# Altium schematic sheet 原理图.SchDoc
size A4
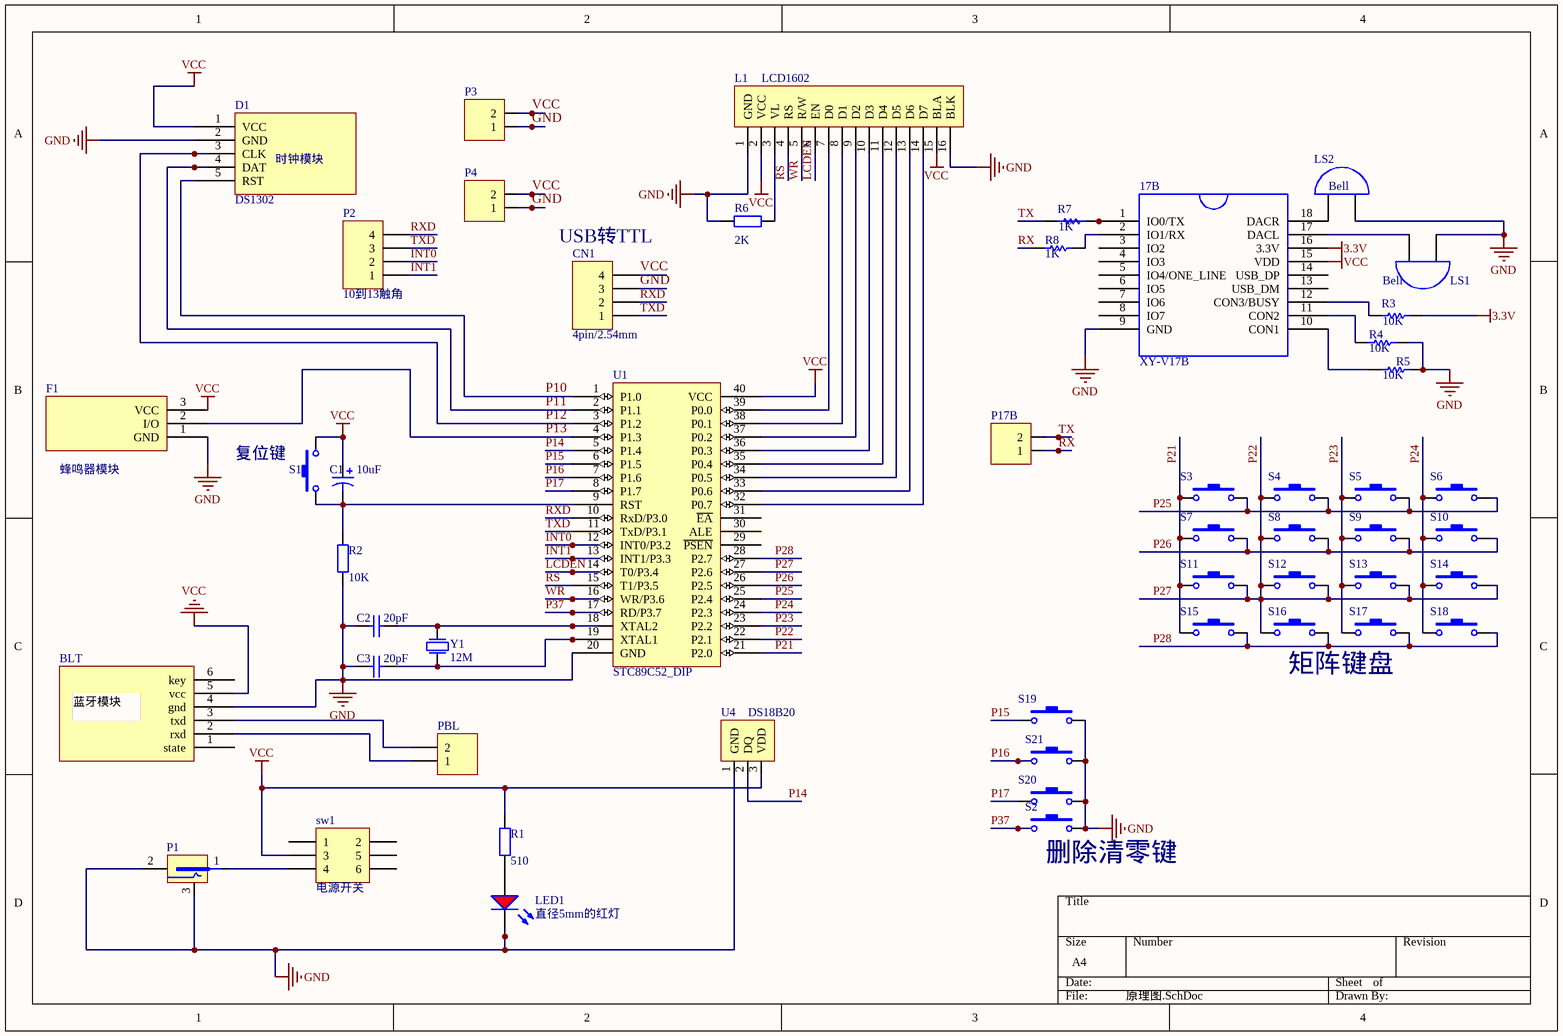
[diagram p0: 原理图.SchDoc]

## Parts
17B  XY-V17B  [17B]
BLT  (no value)  [BLE]
C1  10uF  [CAPPR3.5-8X12]
C2  20pF  [P4]
C3  20pF  [P4]
CN1  4pin/2.54mm  [CN1]
D1  DS1302  [DS1302]
F1  蜂鸣器模块  [BEEP]
L1  LCD1602  [LCD1602]
LED1  直径5mm的红灯  [LED_#5_Red]
LS1  Bell  [PIN2]
LS2  Bell  [PIN2]
P1  电源输入  [POWER111]  (value not drawn)
P2  10到13触角  [CN1]
P3  (no value)  [P4]
P4  (no value)  [P4]
P17B  (no value)  [P4]
PBL  (no value)  [P4]
R1  value 510  [AXIAL-0.4]
R2  value 10K  [AXIAL-0.4]
R3  value 10K  [AXIAL-0.3]
R4  value 10K  [AXIAL-0.3]
R5  value 10K  [AXIAL-0.3]
R6  value 2K  [AXIAL-0.4]
R7  value 1K  [AXIAL-0.3]
R8  value 1K  [AXIAL-0.3]
S1  SW-PB  [KEY2]  (value not drawn)
S2  SW-PB  [KEY2]  (value not drawn)
S3  SW-PB  [KEY2]  (value not drawn)
S4  SW-PB  [KEY2]  (value not drawn)
S5  SW-PB  [KEY2]  (value not drawn)
S6  SW-PB  [KEY2]  (value not drawn)
S7  SW-PB  [KEY2]  (value not drawn)
S8  SW-PB  [KEY2]  (value not drawn)
S9  SW-PB  [KEY2]  (value not drawn)
S10  SW-PB  [KEY2]  (value not drawn)
S11  SW-PB  [KEY2]  (value not drawn)
S12  SW-PB  [KEY2]  (value not drawn)
S13  SW-PB  [KEY2]  (value not drawn)
S14  SW-PB  [KEY2]  (value not drawn)
S15  SW-PB  [KEY2]  (value not drawn)
S16  SW-PB  [KEY2]  (value not drawn)
S17  SW-PB  [KEY2]  (value not drawn)
S18  SW-PB  [KEY2]  (value not drawn)
S19  SW-PB  [KEY2]  (value not drawn)
S20  SW-PB  [KEY2]  (value not drawn)
S21  SW-PB  [KEY2]  (value not drawn)
sw1  电源开关  [电源]
U1  STC89C52_DIP  [DIP-40]
U4  DS18B20  [DS18B20]
Y1  12M  [XTAL-49/U_N]

## Nets
3.3V: 17B.16(3.3V) R3.2
GND: 17B.9(GND) BLT.4(gnd) C2.1 C3.1 CN1.3 D1.2(GND) F1.1(GND) L1.1(GND) L1.16(BLK) LED1.2 LS1.1(A) LS2.2(B) P1.2 P1.3 P3.1 P4.1 R2.2 R4.2 R5.2 R6.1 S2.2 S19.2 S20.2 S21.2 U1.20(GND) U4.1(GND)
VCC: 17B.15(VDD) BLT.5(vcc) C1.1 CN1.4 D1.1(VCC) F1.3(VCC) L1.2(VCC) L1.15(BLA) P3.2 P4.2 R1.1 S1.2 sw1.3 U1.40(VCC) U4.3(VDD)
INT0: P2.2 U1.12(INT0/P3.2)
INT1: P2.1 U1.13(INT1/P3.3)
LCDEN: L1.6(EN) U1.14(T0/P3.4)
P10: D1.5(RST) U1.1(P1.0)
P11: D1.4(DAT) U1.2(P1.1)
P12: D1.3(CLK) U1.3(P1.2)
P13: F1.2(I/O) U1.4(P1.3)
P14: U1.5(P1.4) U4.2(DQ)
P15: S19.1 U1.6(P1.5)
P16: S21.1 U1.7(P1.6)
P17: S20.1 U1.8(P1.7)
P21: S3.1 S7.1 S11.1 S15.1 U1.21(P2.0)
P22: S4.1 S8.1 S11.2 S12.1 S12.2 S13.2 S14.2 S16.1 U1.22(P2.1) U1.27(P2.6)  [also labelled P27]
P23: S5.1 S9.1 S13.1 S17.1 U1.23(P2.2)
P24: S6.1 S10.1 S14.1 S18.1 U1.24(P2.3)
P25: S3.2 S4.2 S5.2 S6.2 U1.25(P2.4)
P26: S7.2 S8.2 S9.2 S10.2 U1.26(P2.5)
P28: S15.2 S16.2 S17.2 S18.2 U1.28(P2.7)
P37: S2.1 U1.17(RD/P3.7)
RS: L1.4(RS) U1.15(T1/P3.5)
RX: P17B.1 R8.1
RXD: CN1.2 P2.4 U1.10(RxD/P3.0)
TX: P17B.2 R7.1
TXD: CN1.1 P2.3 U1.11(TxD/P3.1)
WR: L1.5(R/W) U1.16(WR/P3.6)
Net17B_1: 17B.1(IO0/TX) R7.2
Net17B_2: 17B.2(IO1/RX) R8.2
Net17B_10: 17B.10(CON1) R5.1
Net17B_11: 17B.11(CON2) R4.1
Net17B_12: 17B.12(CON3/BUSY) R3.1
Net17B_17: 17B.17(DACL) LS1.2(B)
Net17B_18: 17B.18(DACR) LS2.1(A)
NetBLT_2: BLT.2(rxd) PBL.1
NetBLT_3: BLT.3(txd) PBL.2
NetC1_2: C1.2 R2.1 S1.1 U1.9(RST)
NetC2_2: C2.2 U1.18(XTAL2) Y1.1(P1)
NetC3_2: C3.2 U1.19(XTAL1) Y1.2(P2)
NetL1_3: L1.3(VL) R6.2
NetL1_7: L1.7(D0) U1.39(P0.0)
NetL1_8: L1.8(D1) U1.38(P0.1)
NetL1_9: L1.9(D2) U1.37(P0.2)
NetL1_10: L1.10(D3) U1.36(P0.3)
NetL1_11: L1.11(D4) U1.35(P0.4)
NetL1_12: L1.12(D5) U1.34(P0.5)
NetL1_13: L1.13(D6) U1.33(P0.6)
NetL1_14: L1.14(D7) U1.32(P0.7)
NetLED1_1: LED1.1 R1.2
NetP1_1: P1.1 sw1.4

Not connected (* = marked no-connect by the designer): 17B 3(IO2) 4(IO3) 5(IO4/ONE_LINE) 6(IO5) 7(IO6) 8(IO7) 13(USB_DM) 14(USB_DP); BLT 1(state) 6(key); sw1 1 2 5 6; U1 29(~{PSEN}) 30(ALE) 31(~{EA})

## Notes on the sheet
- (near CN1) USB转TTL
- 复位键
- 矩阵键盘
- (near S2) 删除清零键
- (in symbol DS1302) 时钟模块
- (in symbol lanya) 蓝牙模块

## Library data of the parts
17B = MODULE
BLT = lanya
C1 = Cap Pol1: Polarized Capacitor (Radial); Published: 8-Jun-2000; LatestRevisionDate: 17-Jul-2002; LatestRevisionNote: Re-released for DXP Platform.; PackageReference: RB7.6-15; Publisher: Altium Limited
C2 C3 = Cap_0603: 0603贴片电容; Value: 104; Package: 0603; 常见贴片电容尺寸图: https://wenku.baidu.com/view/21d5206100f69e3143323968011ca300a6c3f6b2.html
CN1 P2 = MHDR1X4: Header, 4-Pin; LatestRevisionDate: 17-Jul-2002; LatestRevisionNote: Re-released for DXP Platform.; Publisher: Altium Limited
F1 = fengmingqi
LED1 = LED_5#红灯: 直径5mm的发光二极管; Value: 红灯
LS1 LS2 = Bell: Electrical Bell; Published: 24-Mar-1999; LatestRevisionDate: 17-Jul-2002; LatestRevisionNote: Re-released for DXP Platform.; PackageReference: PIN2; Publisher: Altium Limited
P1 = POWER
P3 P4 P17B PBL = Header 2: Header, 2-Pin; LatestRevisionDate: 17-Jul-2002; LatestRevisionNote: Re-released for DXP Platform.; Publisher: Altium Limited
R1 R2 R6 = Res2: Resistor; Published: 8-Jun-2000; LatestRevisionDate: 17-Jul-2002; LatestRevisionNote: Re-released for DXP Platform.; PackageReference: AXIAL-0.4; Publisher: Altium Limited; PackageDescription: Axial Device, Thru-Hole; 2 Leads; 0.4 in Pin Spacing
R3-R5 R7 R8 = Res1: Resistor; Published: 8-Jun-2000; LatestRevisionDate: 17-Jul-2002; LatestRevisionNote: Re-released for DXP Platform.; PackageReference: AXIAL-0.3; Publisher: Altium Limited; PackageDescription: Axial Device, Thru-Hole; 2 Leads; 0.3 in Pin Spacing
S1-S21 = SW-PB: Switch; Published: 24-Mar-1999; LatestRevisionDate: 17-Jul-2002; LatestRevisionNote: Re-released for DXP Platform.; PackageReference: SPST-2; Publisher: Altium Limited
sw1 = Header 3X2: Header, 3-Pin, Dual row; LatestRevisionDate: 17-Jul-2002; LatestRevisionNote: Re-released for DXP Platform.; Publisher: Altium Limited
Y1 = 16M: Crystal Oscillator